# EAGLE schematic answer (EAGLE 7.7.0)

## Sheet 1 of 2: Sheet 1 - has U1 whose VCC pin needs to drive U2 on sheet 2.
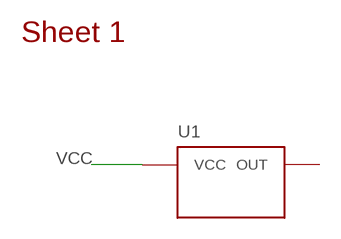
[diagram p0: schematic, sheet 1]

### Parts
U1  DRIVER  BLOCK2  (no package)

### Nets
VCC: U1.VCC ; also sheet 2
Unconnected: U1.OUT

### Notes on the sheet
- Sheet 1

## Sheet 2 of 2: Sheet 2 - has U2 whose VCC pin must connect back to sheet 1's VCC.
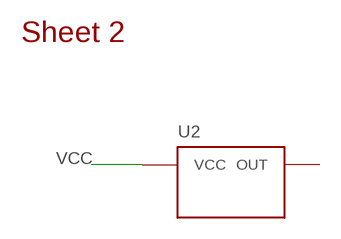
[diagram p1: schematic, sheet 2]

### Parts
U2  CONSUMER  BLOCK2  (no package)

### Nets
VCC: U2.VCC ; also sheet 1
Unconnected: U2.OUT

### Notes on the sheet
- Sheet 2

## Library data of the parts
U1 U2 = simple:BLOCK2